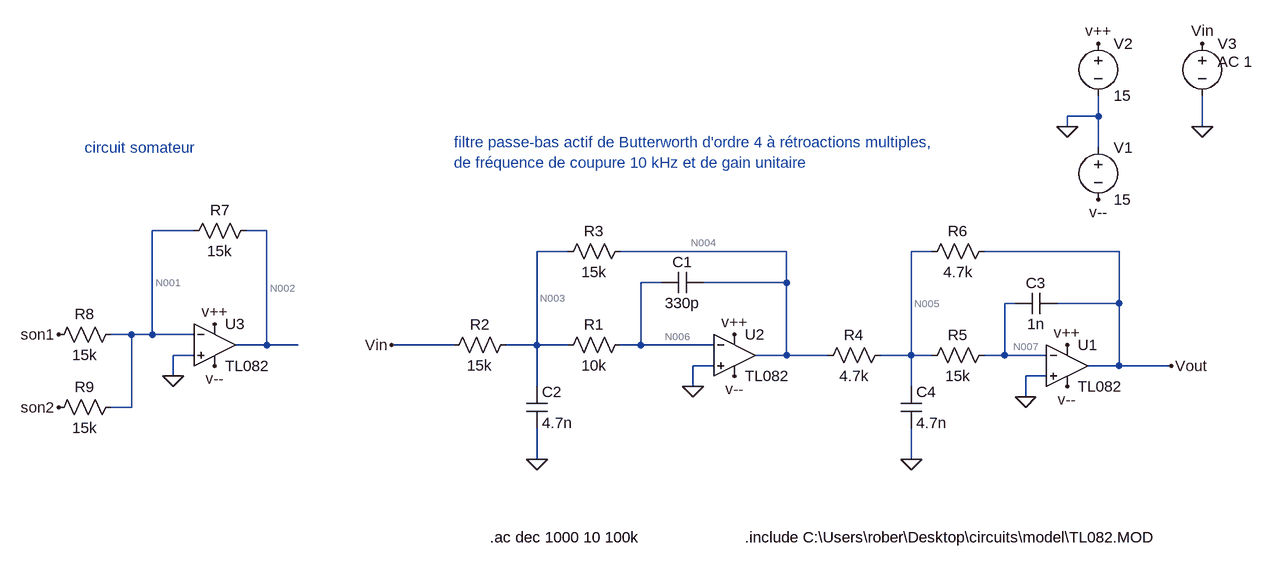
[diagram p0: schematic prep2.asc]
prep2.asc, the LTspice schematic file:
Version 4.1
SHEET 1 880 680
WIRE 512 -288 512 -320
WIRE 512 -288 464 -288
WIRE 464 -272 464 -288
WIRE 672 -272 672 -320
WIRE 512 -240 512 -288
WIRE -880 -112 -944 -112
WIRE -768 -112 -800 -112
WIRE -304 -80 -352 -80
WIRE 32 -80 -224 -80
WIRE 256 -80 224 -80
WIRE 544 -80 336 -80
WIRE -160 -32 -192 -32
WIRE 32 -32 32 -80
WIRE 32 -32 -96 -32
WIRE 384 0 368 0
WIRE 544 0 544 -80
WIRE 544 0 448 0
WIRE -976 48 -1008 48
WIRE -944 48 -944 -112
WIRE -944 48 -976 48
WIRE -880 48 -944 48
WIRE -768 64 -768 -112
WIRE -768 64 -816 64
WIRE -720 64 -768 64
WIRE -480 64 -576 64
WIRE -352 64 -352 -80
WIRE -352 64 -400 64
WIRE -304 64 -352 64
WIRE -192 64 -192 -32
WIRE -192 64 -224 64
WIRE -80 64 -192 64
WIRE -880 80 -912 80
WIRE 32 80 32 -32
WIRE 32 80 -16 80
WIRE 96 80 32 80
WIRE 224 80 224 -80
WIRE 224 80 176 80
WIRE 256 80 224 80
WIRE 368 80 368 0
WIRE 368 80 336 80
WIRE 432 80 368 80
WIRE -80 96 -112 96
WIRE 544 96 544 0
WIRE 544 96 496 96
WIRE 624 96 544 96
WIRE -912 112 -912 80
WIRE 432 112 400 112
WIRE -352 128 -352 64
WIRE -112 128 -112 96
WIRE 224 128 224 80
WIRE 400 144 400 112
WIRE -976 160 -976 48
WIRE -976 160 -1008 160
WIRE -352 240 -352 192
WIRE 224 240 224 192
FLAG 464 -272 0
FLAG 512 -400 v++
FLAG 464 64 v++
FLAG 512 -160 v--
FLAG 464 128 v--
FLAG -48 48 v++
FLAG -48 112 v--
FLAG -112 128 0
FLAG 400 144 0
FLAG -352 240 0
FLAG 224 240 0
FLAG -576 64 Vin
FLAG 624 96 Vout
FLAG 672 -272 0
FLAG 672 -400 Vin
FLAG -848 32 v++
FLAG -848 96 v--
FLAG -912 112 0
FLAG -1088 48 son1
FLAG -1088 160 son2
SYMBOL OpAmps\\opamp2 464 32 R0
SYMATTR InstName U1
SYMATTR Value TL082
SYMBOL voltage 512 -256 R0
WINDOW 123 0 0 Left 0
WINDOW 39 0 0 Left 0
SYMATTR InstName V1
SYMATTR Value 15
SYMBOL voltage 512 -416 R0
WINDOW 123 0 0 Left 0
WINDOW 39 0 0 Left 0
SYMATTR InstName V2
SYMATTR Value 15
SYMBOL OpAmps\\opamp2 -48 16 R0
SYMATTR InstName U2
SYMATTR Value TL082
SYMBOL res -208 48 R90
WINDOW 0 0 56 VBottom 2
WINDOW 3 32 56 VTop 2
SYMATTR InstName R1
SYMATTR Value 10k
SYMBOL res -384 48 R90
WINDOW 0 0 56 VBottom 2
WINDOW 3 32 56 VTop 2
SYMATTR InstName R2
SYMATTR Value 15k
SYMBOL res -208 -96 R90
WINDOW 0 0 56 VBottom 2
WINDOW 3 32 56 VTop 2
SYMATTR InstName R3
SYMATTR Value 15k
SYMBOL cap -96 -48 R90
WINDOW 0 0 32 VBottom 2
WINDOW 3 32 32 VTop 2
SYMATTR InstName C1
SYMATTR Value 330p
SYMBOL cap -368 128 R0
SYMATTR InstName C2
SYMATTR Value 4.7n
SYMBOL res 192 64 R90
WINDOW 0 0 56 VBottom 2
WINDOW 3 32 56 VTop 2
SYMATTR InstName R4
SYMATTR Value 4.7k
SYMBOL res 352 64 R90
WINDOW 0 0 56 VBottom 2
WINDOW 3 32 56 VTop 2
SYMATTR InstName R5
SYMATTR Value 15k
SYMBOL res 352 -96 R90
WINDOW 0 0 56 VBottom 2
WINDOW 3 32 56 VTop 2
SYMATTR InstName R6
SYMATTR Value 4.7k
SYMBOL cap 448 -16 R90
WINDOW 0 0 32 VBottom 2
WINDOW 3 32 32 VTop 2
SYMATTR InstName C3
SYMATTR Value 1n
SYMBOL cap 208 128 R0
SYMATTR InstName C4
SYMATTR Value 4.7n
SYMBOL voltage 672 -416 R0
WINDOW 123 24 44 Left 2
WINDOW 39 0 0 Left 0
SYMATTR Value2 AC 1
SYMATTR InstName V3
SYMATTR Value ""
SYMBOL OpAmps\\opamp2 -848 0 R0
SYMATTR InstName U3
SYMATTR Value TL082
SYMBOL res -784 -128 R90
WINDOW 0 0 56 VBottom 2
WINDOW 3 32 56 VTop 2
SYMATTR InstName R7
SYMATTR Value 15k
SYMBOL res -992 32 R90
WINDOW 0 0 56 VBottom 2
WINDOW 3 32 56 VTop 2
SYMATTR InstName R8
SYMATTR Value 15k
SYMBOL res -992 144 R90
WINDOW 0 0 56 VBottom 2
WINDOW 3 32 56 VTop 2
SYMATTR InstName R9
SYMATTR Value 15k
TEXT -32 360 Left 2 !.include C:\\Users\\rober\\Desktop\\circuits\\model\\TL082.MOD
TEXT -480 -248 Left 2 ;filtre passe-bas actif de Butterworth d'ordre 4 à rétroactions multiples, \nde fréquence de coupure 10 kHz et de gain unitaire
TEXT -424 360 Left 2 !.ac dec 1000 10 100k
TEXT -1048 -240 Left 2 ;circuit somateur

The netlist it stands for:
* prep2.asc
X§U1 0 N007 v++ v-- Vout TL082  ; pins In+ In- V+ V- OUT
V1 0 v-- 15
V2 v++ 0 15
X§U2 0 N006 v++ v-- N004 TL082  ; pins In+ In- V+ V- OUT
R1 N006 N003 10k
R2 N003 Vin 15k
R3 N004 N003 15k
C1 N004 N006 330p
C2 N003 0 4.7n
R4 N005 N004 4.7k
R5 N007 N005 15k
R6 Vout N005 4.7k
C3 Vout N007 1n
C4 N005 0 4.7n
V3 Vin 0 AC 1
X§U3 0 N001 v++ v-- N002 TL082  ; pins In+ In- V+ V- OUT
R7 N002 N001 15k
R8 N001 son1 15k
R9 N001 son2 15k
.include C:\Users\rober\Desktop\circuits\model\TL082.MOD
* filtre passe-bas actif de Butterworth d'ordre 4 à rétroactions multiples,
* de fréquence de coupure 10 kHz et de gain unitaire
.ac dec 1000 10 100k
* circuit somateur
.backanno
.end

* Results of the author's LTspice run, read from the files saved beside the schematic
* Operating Point, zero values left out:
*   V(n001) = 10.97 µV
*   V(n002) = 11.65 µV
*   V(n003) = 11.42 µV
*   V(n004) = 23.52 µV
*   V(n005) = 11.65 µV
*   V(n006) = 10.97 µV
*   V(n007) = 10.97 µV
*   V(son1) = 10.97 µV
*   V(son2) = 10.97 µV
*   V(v++) = 15 V
*   V(v--) = -15 V
*   I(R1) = -45.05 pA
*   I(R2) = 761.4 pA
*   I(R3) = 806.5 pA
*   I(R4) = -2.526 nA
*   I(R5) = -45.05 pA
*   I(R6) = -2.481 nA
*   I(R7) = 45.05 pA
*   I(V1) = -42.58 mA
*   I(V2) = -42.58 mA
*   I(V3) = 761.4 pA
*   Ix(u1:1) = 45.05 pA
*   Ix(u1:2) = 45.05 pA
*   Ix(u1:3) = 14.19 mA
*   Ix(u1:4) = -14.19 mA
*   Ix(u1:5) = 2.481 nA
*   Ix(u2:1) = 45.05 pA
*   Ix(u2:2) = 45.05 pA
*   Ix(u2:3) = 14.19 mA
*   Ix(u2:4) = -14.19 mA
*   Ix(u2:5) = -3.332 nA
*   Ix(u3:1) = 45.05 pA
*   Ix(u3:2) = 45.05 pA
*   Ix(u3:3) = 14.19 mA
*   Ix(u3:4) = -14.19 mA
*   Ix(u3:5) = -45.05 pA
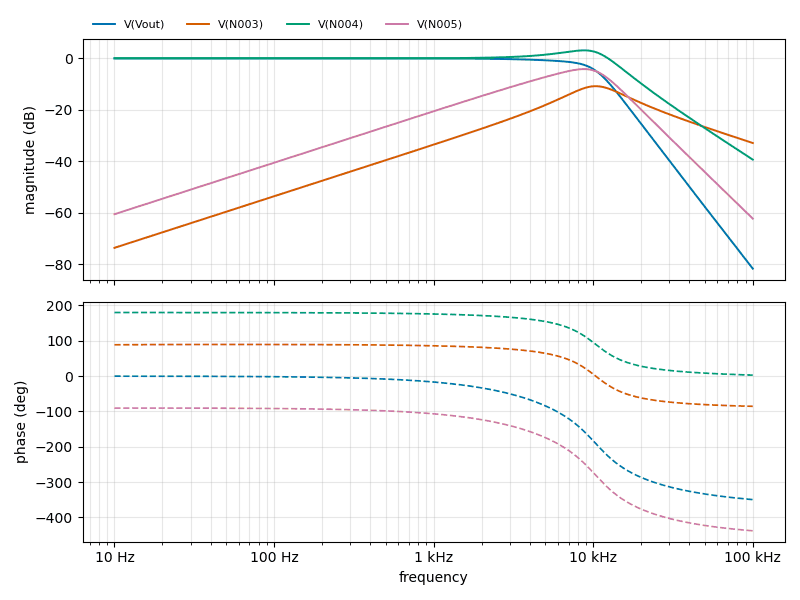
[diagram p1: AC Analysis of prep2.asc, plotted from the saved traces]
* AC Analysis, 1 run:
*   V(Vout): -0.00 dB at 10 Hz, -81.62 dB at 100 kHz, peak -0.00 dB at 10 Hz, 3 dB below the peak at 9.202 kHz
*   V(N003): -73.54 dB at 10 Hz, -32.86 dB at 100 kHz, peak -10.79 dB at 10.35 kHz, 3 dB below the peak at 7.164 kHz and 14.98 kHz
*   V(N004): -0.00 dB at 10 Hz, -39.31 dB at 100 kHz, peak 3.11 dB at 8.77 kHz, 3 dB below the peak at 1.31 kHz and 12.32 kHz
*   V(N005): -60.49 dB at 10 Hz, -62.21 dB at 100 kHz, peak -4.16 dB at 8.75 kHz, 3 dB below the peak at 5.051 kHz and 11.99 kHz